# EAGLE design INA2321Bioamp (EAGLE 7.4.0)
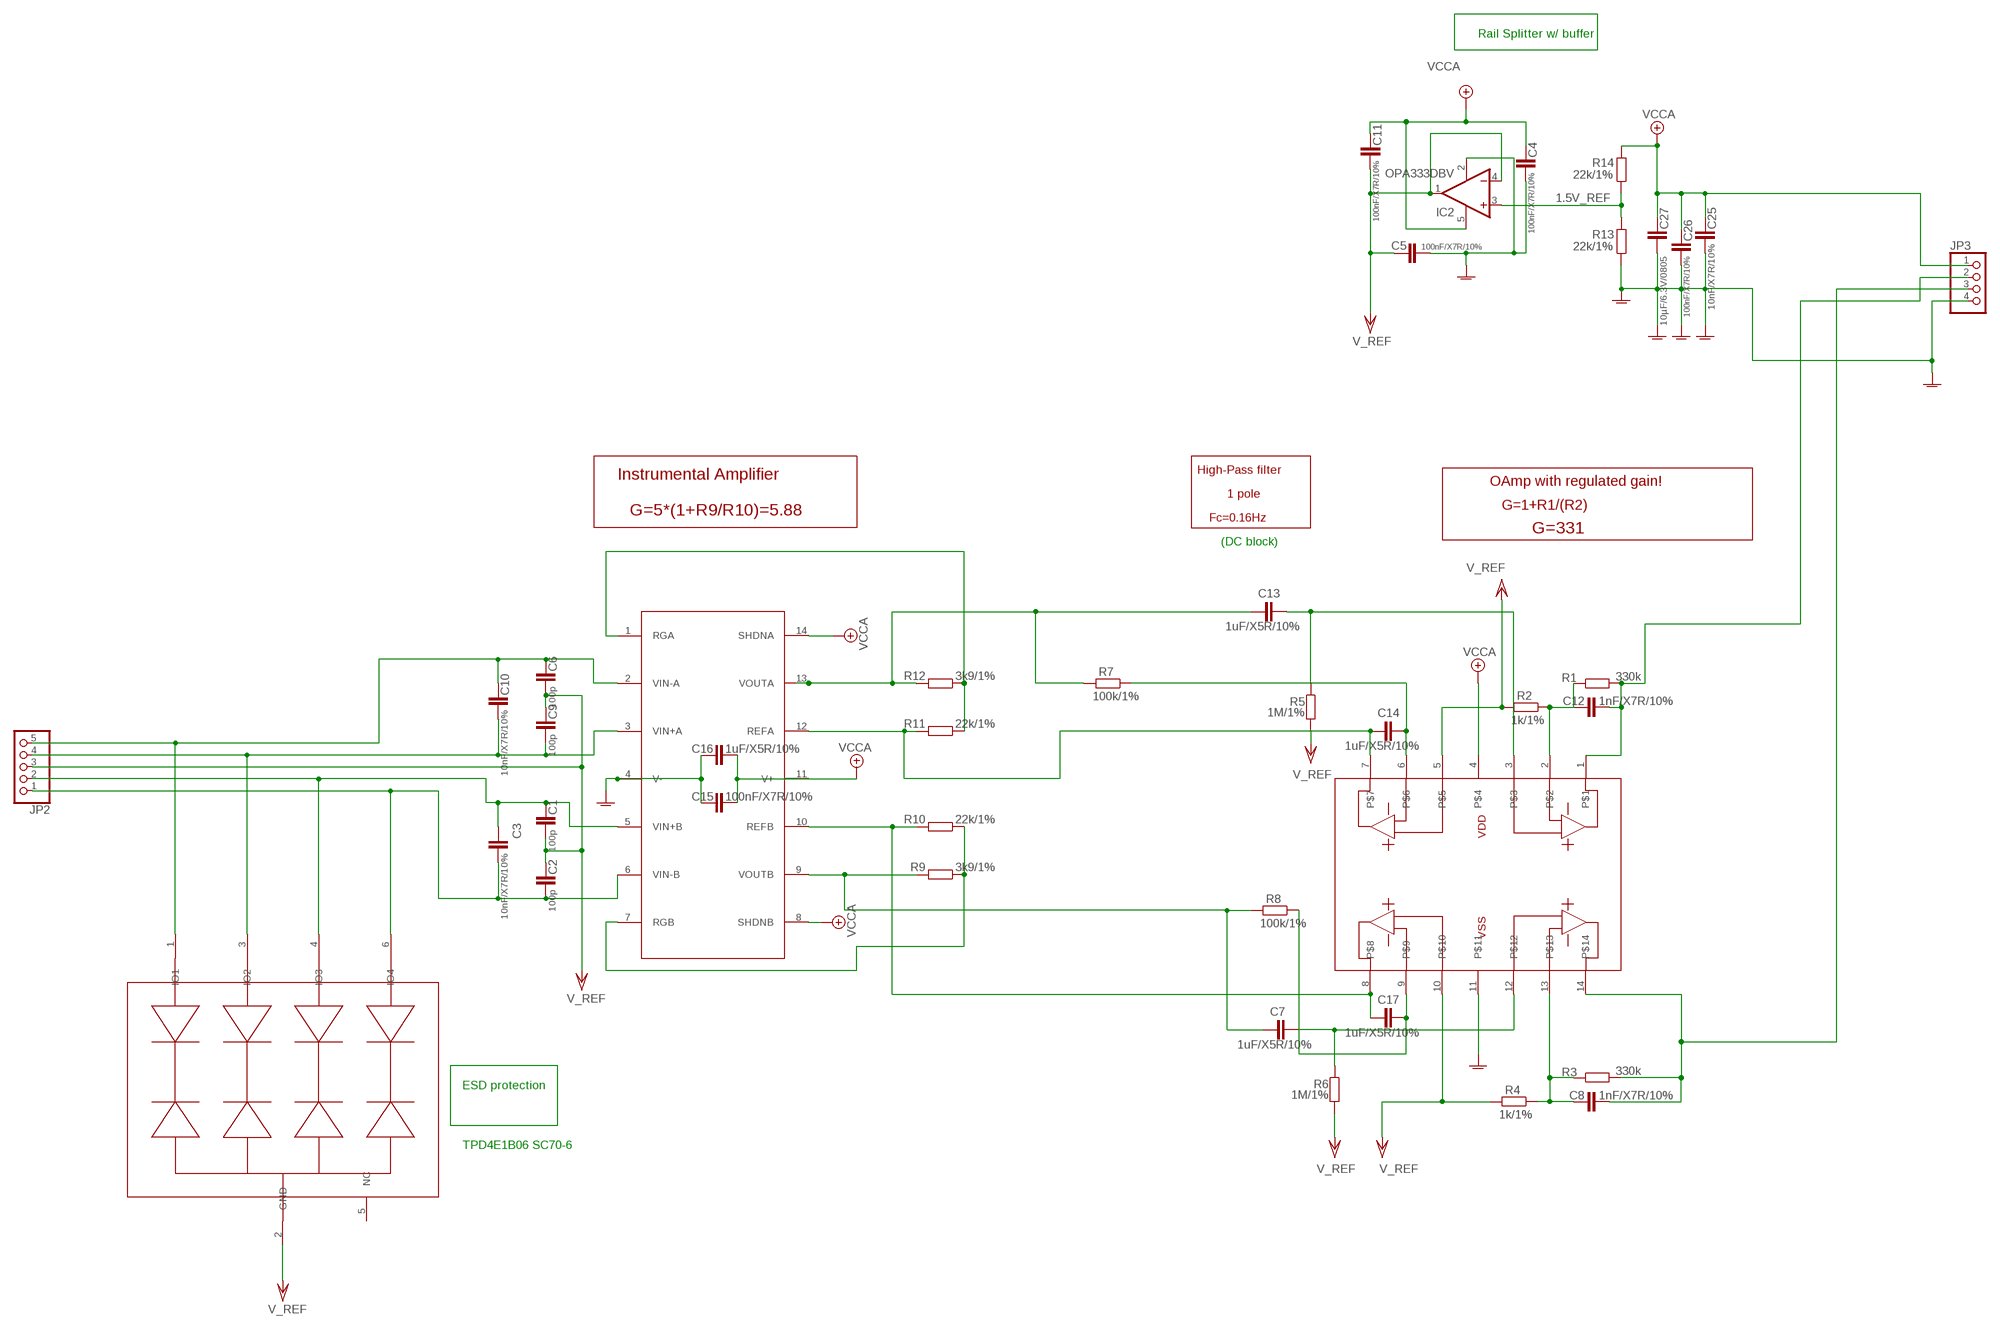
[diagram p0: schematic, sheet 1]

## Parts
C1  100p  C-EUC0603_DWS  [C0603_DWS]
C2  100p  C-EUC0603_DWS  [C0603_DWS]
C3  10nF/X7R/10%  C-EUC0603_DWS  [C0603_DWS]
C4  100nF/X7R/10%  C-EUC0603_DWS  [C0603_DWS]
C5  100nF/X7R/10%  C-EUC0603_DWS  [C0603_DWS]
C6  100p  C-EUC0603_DWS  [C0603_DWS]
C7  1uF/X5R/10%  C-EUC0603_DWS  [C0603_DWS]
C8  1nF/X7R/10%  C-EUC0603_DWS  [C0603_DWS]
C9  100p  C-EUC0603_DWS  [C0603_DWS]
C10  10nF/X7R/10%  C-EUC0603_DWS  [C0603_DWS]
C11  100nF/X7R/10%  C-EUC0603_DWS  [C0603_DWS]
C12  1nF/X7R/10%  C-EUC0603_DWS  [C0603_DWS]
C13  1uF/X5R/10%  C-EUC0603_DWS  [C0603_DWS]
C14  1uF/X5R/10%  C-EUC0603_DWS  [C0603_DWS]
C15  100nF/X7R/10%  C-EUC0603_DWS  [C0603_DWS]
C16  1uF/X5R/10%  C-EUC0603_DWS  [C0603_DWS]
C17  1uF/X5R/10%  C-EUC0603_DWS  [C0603_DWS]
C25  10nF/X7R/10%  C-EUC0603_DWS  [C0603_DWS]
C26  100nF/X7R/10%  C-EUC0603_DWS  [C0603_DWS]
C27  10µF/6.3V/0805  C-EUC0805_5MIL_DWS  [C0805_5MIL_DWS]
IC2  OPA333DBV  [SOT23-5]
JP2  PINHD-1X5  [1X05]
JP3  PINHD-1X4  [1X04]
R1  330k  R-EU_R0603_5MIL_DWS  [R0603_5MIL_DWS]
R2  1k/1%  R-EU_R0603_5MIL_DWS  [R0603_5MIL_DWS]
R3  330k  R-EU_R0603_5MIL_DWS  [R0603_5MIL_DWS]
R4  1k/1%  R-EU_R0603_5MIL_DWS  [R0603_5MIL_DWS]
R5  1M/1%  R-EU_R0603_5MIL_DWS  [R0603_5MIL_DWS]
R6  1M/1%  R-EU_R0603_5MIL_DWS  [R0603_5MIL_DWS]
R7  100k/1%  R-EU_R0603_5MIL_DWS  [R0603_5MIL_DWS]
R8  100k/1%  R-EU_R0603_5MIL_DWS  [R0603_5MIL_DWS]
R9  3k9/1%  R-EU_R0603_5MIL_DWS  [R0603_5MIL_DWS]
R10  22k/1%  R-EU_R0603_5MIL_DWS  [R0603_5MIL_DWS]
R11  22k/1%  R-EU_R0603_5MIL_DWS  [R0603_5MIL_DWS]
R12  3k9/1%  R-EU_R0603_5MIL_DWS  [R0603_5MIL_DWS]
R13  22k/1%  R-EU_R0603_5MIL_DWS  [R0603_5MIL_DWS]
R14  22k/1%  R-EU_R0603_5MIL_DWS  [R0603_5MIL_DWS]
U$1  INA2321  [TSSOP14]
U$2  TPD4E1B06  [SC70-6L]
U$3  MCP609  [TSSOP14]

## Nets
1.5V_REF: IC2.3(+IN) R13.2 R14.1
+5V: C4.1 C11.1 C15.2 C16.2 C25.1 C26.1 C27.1 IC2.5(V+) JP3.1 R14.2 U$1.8(SHDNB) U$1.11(V+) U$1.14(SHDNA) U$3.4 ; supply symbol labelled VCCA
GNDA: C4.2 C5.2 C15.1 C16.1 C25.2 C26.2 C27.2 IC2.2(V-) JP3.4 R13.1 U$1.4(V-) U$3.11
N$1: C8.2 JP3.3 R3.2 U$3.14
N$2: C6.1 C10.1 JP2.5 U$1.2(VIN-A) U$2.1(IO1)
N$3: C13.1 R7.2 R12.2 U$1.13(VOUTA)
N$4: R11.1 R12.1 U$1.1(RGA)
N$5: C13.2 R5.1 U$3.3
N$6: C12.1 R1.1 R2.1 U$3.2
N$7: C12.2 JP3.2 R1.2 U$3.1
N$8: C9.2 C10.2 JP2.4 U$1.3(VIN+A) U$2.3(IO2)
N$9: R9.1 R10.1 U$1.7(RGB)
N$11: C1.1 C3.1 JP2.2 U$1.5(VIN+B) U$2.4(IO3)
N$13: C2.2 C3.2 JP2.1 U$1.6(VIN-B) U$2.6(IO4)
N$15: C14.2 R7.1 U$3.6
N$17: C17.2 R8.1 U$3.9
N$18: C17.1 R10.2 U$1.10(REFB) U$3.8
N$19: C14.1 R11.2 U$1.12(REFA) U$3.7
N$20: C7.2 R6.1 U$3.12
N$83: C7.1 R8.2 R9.2 U$1.9(VOUTB)
N$105: C8.1 R3.1 R4.1 U$3.13
VCC/2: C1.2 C2.1 C5.1 C6.2 C9.1 C11.2 IC2.1(OUT) IC2.4(-IN) JP2.3 R2.2 R4.2 R5.2 R6.2 U$2.2(GND) U$3.5 U$3.10 ; supply symbol labelled V_REF
Unconnected: U$2.5(NC)

## Notes on the sheet
- Rail Splitter w/ buffer
- High-Pass filter
- Instrumental Amplifier
- OAmp with regulated gain!
- 1 pole
- G=1+R1/(R2)
- G=5*(1+R9/R10)=5.88
- Fc=0.16Hz
- G=331
- (DC block)
- ESD protection
- TPD4E1B06 SC70-6

## Library data of the parts
C1-C17 C25-C27 = rcl:C-EU: CAPACITOR, European symbol
IC2 = linear:OPA333: 1.8V, microPOWER CMOS OPERATIONAL AMPLIFIERS Zerø-Drift Series Source: Texas Instruments (Burr-Brown) .. U11 opa333 Operational Amp.pdf
JP2 = pinhead:PINHD-1X5: PIN HEADER
JP3 = pinhead:PINHD-1X4: PIN HEADER
R1-R14 = rcl:R-EU_: RESISTOR, European symbol
U$1 = INA2321:INA2321
U$2 = TPD4E1B06:TPD4E1B06
U$3 = MCP609tssop:MCP609

## Net classes
1 pwr: width 0.4 mm, drill 0.6 mm, clearance 0.23 mm

## Board
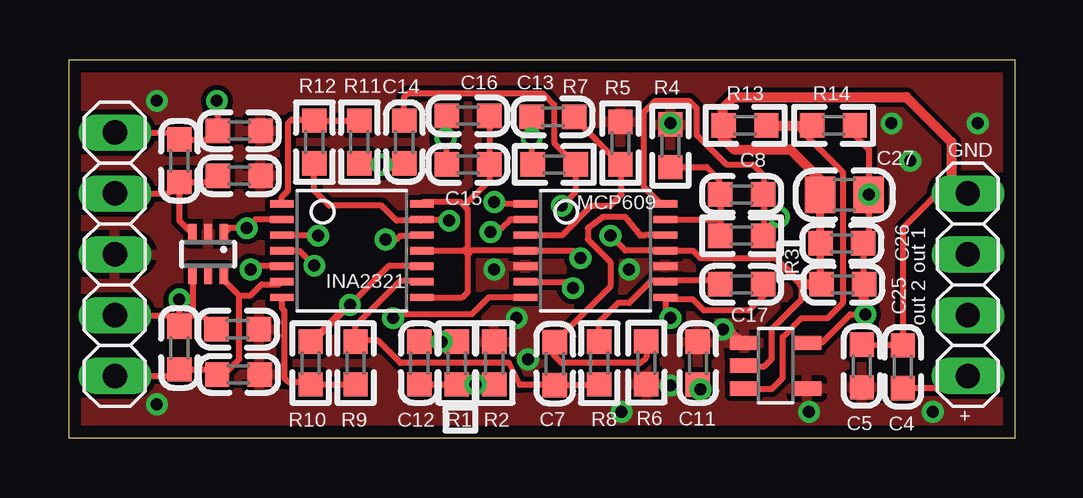
[diagram p1: board, top side]
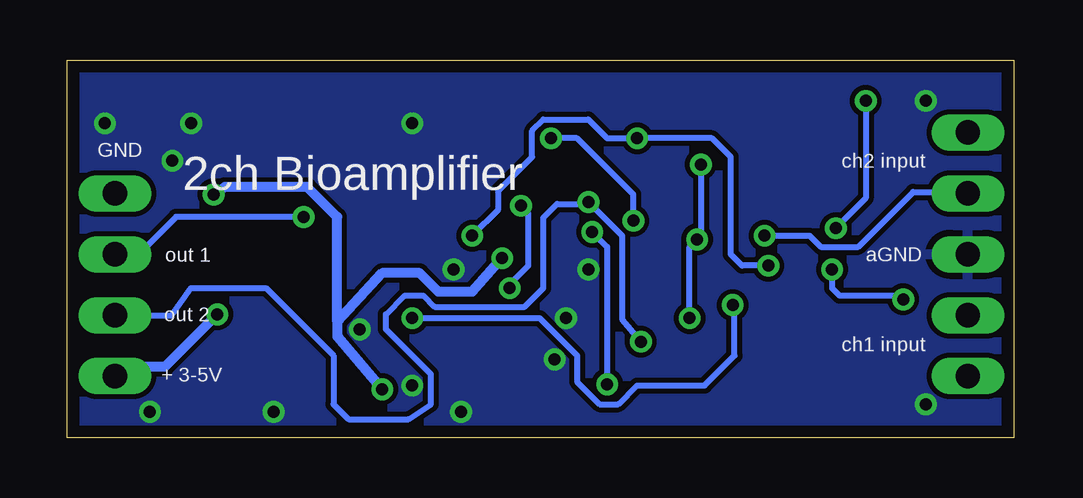
[diagram p2: board, bottom side, seen from below]

Size 39.46 x 15.75 mm. Coordinates in mm from the lower left corner, seen from the top.
Outline: 0,0 39.46,0 39.46,15.75 0,15.75 0,0
Copper layers (1*16): Top 0.035mm / dielectric 1.5mm / Bottom 0.035mm
Design rules "default *": minimum track width 10mil, minimum drill 24mil, track to track 8mil, track to pad 8mil, pad to pad 8mil, via to via 8mil, smd to smd 8mil, copper to edge 20mil, drill to drill 8mil, minimum pad ring 10mil, minimum via ring 8mil, stop-mask expansion 4mil, vias tented up to drill 0.60198125mm, thermal gap 10mil

### Footprints (pad centres in the part's own frame; a part is rotated, then mirrored left to right if it is on the bottom)
C0603_DWS = smd 1.016 x 1.016: 1 -0.889,0; 2 0.889,0
C0805_5MIL_DWS = smd 1.27 x 1.524: 1 -1.016,0; 2 1.016,0
SOT23-5 = smd 0.6 x 1.2: 1 -0.95,-1.306; 2 0,-1.306; 3 0.95,-1.306; 4 0.95,1.306; 5 -0.95,1.306
1X05 = drill 1.016 long: 1 -5.08,0; 2 -2.54,0; 3 0,0; 4 2.54,0; 5 5.08,0
1X04 = drill 1.016 long: 1 -3.81,0; 2 -1.27,0; 3 1.27,0; 4 3.81,0
R0603_5MIL_DWS = smd 1.016 x 1.016: 1 -0.889,0; 2 0.889,0
TSSOP14 = smd 0.305 x 0.991: 1 -1.95,-2.918; 2 -1.3,-2.918; 3 -0.65,-2.918; 4 0,-2.918; 5 0.65,-2.918; 6 1.3,-2.918; 7 1.95,-2.918; 8 1.95,2.918; 9 1.3,2.918; 10 0.65,2.918; 11 0,2.918; 12 -0.65,2.918; 13 -1.3,2.918; 14 -1.95,2.918
SC70-6L = smd 0.35 x 0.8: 1 -0.65,-0.85; 2 0,-0.85; 3 0.65,-0.85; 4 0.65,0.85; 5 0,0.85; 6 -0.65,0.85

### Placement (x,y rotation side)
C1  7.04,4.52 0 top
C2  7.07,2.63 180 top
C3  4.61,3.73 270 top
C4  34.76,2.95 90 top
C5  33.06,2.99 90 top
C6  7.11,12.8 0 top
C7  20.25,3.08 90 top
C8  28.05,10.14 0 top
C9  7.11,10.92 180 top
C10  4.61,11.55 270 top
C11  26.22,3.11 90 top
C12  14.61,3.11 90 top
C13  20.18,13.38 0 top
C14  13.98,12.33 90 top
C15  16.64,11.39 0 top
C16  16.64,13.42 0 top
C17  28.05,6.39 180 top
C25  32.26,6.39 180 top
C26  32.22,8.1 180 top
C27  32.32,10.12 180 top
IC2  29.46,3 270 top
JP2  1.92,7.64 90 top
JP3  37.48,6.38 90 top
R1  16.17,3.11 90 top
R2  17.73,3.11 90 top
R3  28.05,8.42 0 top
R4  25.08,12.17 90 top
R5  22.99,12.28 90 top
R6  24.07,3.12 270 top
R7  20.23,11.39 180 top
R8  22.11,3.11 270 top
R9  11.95,3.11 90 top
R10  10.08,3.11 90 top
R11  12.11,12.33 270 top
R12  10.23,12.33 270 top
R13  28.19,13.02 0 top
R14  31.88,13.02 0 top
U$1  11.79,7.8 270 top
U$2  5.81,7.65 180 top
U$3  21.95,7.8 270 top

### Tracks (layer width: path | path; a pad name or v marks a point on that pad's centre or on a via)
1.5V_REF
  Top 0.254: R13.2 30.32,13.02 32.26,11.08 32.26,5.61 31.64,4.98 30.55,4.98 29.76,4.2 29.76,2.48 29.3,2.02 28.19,2.02 IC2.3
  Top 0.406: R13.2 R14.1
+5V  (via drill 0.5)
  Top 0.254: U$1.8 16.41,5.85 16.64,6.08 16.64,7.64 | 16.64,7.64 16.48,7.8 | U$1.11 16.48,7.8 | 16.48,7.8 16.64,7.95 16.64,9.52 16.48,9.67 | 16.48,9.67 16.33,9.83 14.79,9.83 U$1.14 | C16.2 C15.2 17.53,10.72 16.48,9.67 | 16.64,7.64 16.8,7.8 U$3.4 21.01,7.8 v21.33,7.48 | 34.45,2.17 C4.1 36.98,2.06 JP3.1 | R14.2 32.77,12.61 33.36,12.02 v33.36,10.13 C27.1 | C27.1 33.34,8.33 C26.1 33.11,6.43 C25.1 | C27.1 33.8,10.12 v33.36,10.14 | 26.33,2.11 C11.1 26.33,2.17 v26.33,2.02 | IC2.5 31.39,3.95 32.58,5.14 v33.2,5.14
  Top 0.406: 33.11,6.43 33.11,5.23 v33.2,5.14
  Bottom 0.254: 32.89,10.45 v33.36,10.14 | 28.2,4.2
  Bottom 0.406: v33.2,5.14 35.39,2.95 37.09,2.95 JP3.1 | v21.33,7.48 22.58,6.08 23.98,6.08 24.76,6.86 26.33,6.86 28.2,4.83 | 28.2,4.83 28.2,4.2 | 28.2,4.83 28.2,9.2 29.45,10.45 32.89,10.45 | v33.36,10.14 32.9,10.45 | 28.2,4.2 v26.33,2.02
GNDA  (via drill 0.5)
  Top 0.254: U$1.4 9.61,7.8 v10.23,7.17 | C16.1 15.7,12.9 v15.7,12.48 15.75,12.44 C15.1 | v22.58,8.42 23.2,7.8 U$3.11 26.01,7.8 26.33,7.48 29.45,7.48 29.84,7.09 30.08,6.86 | C5.2 32.77,3.84 C4.2 34.76,8.73 36.33,10.3 36.8,10.3 37.36,10.3 JP3.4 | C25.2 31.38,10.72 | 30.55,6.39 30.55,5.77 29.3,4.52 29.3,3.27 28.98,2.95 28.2,2.95 IC2.2
  Top 0.305: R13.1 27.3,12.45 27.73,12.02 | 30.08,12.02 31.33,10.77 31.33,10.14 C27.2 31.31,8.12 C26.2 31.33,6.43 C25.2 | 30.55,6.39 29.84,7.09
  Top 0.406: C25.2 30.55,6.39 | 31.38,10.72 30.08,12.02 27.73,12.02 27.26,12.48 27.26,13.73 27.73,14.2 34.92,14.2 36.8,12.33 36.8,10.3
  Bottom 0.254: v10.23,7.17 11.33,7.17 11.79,7.64 11.79,11.7 12.58,12.48 v15.7,12.48 16.95,12.48 17.73,13.27 19.61,13.27 20.08,12.8 20.08,11.7 21.48,10.3 21.48,9.52 v22.58,8.42
N$1  (via drill 0.5)
  Top 0.254: 28.98,8.58 28.98,10.3 28.93,10.25 C8.2 28.98,10.19 28.98,10.92 28.51,11.39 27.42,11.39 26.17,12.64 26.17,13.73 25.86,14.05 24.45,14.05 23.98,13.58 23.98,10.45 24.69,9.75 U$3.14 | R3.2 28.98,8.47 28.98,8.58 | 28.98,8.58 v29.61,9.2
  Bottom 0.254: v29.61,9.2 34.92,9.2 36.48,7.64 JP3.3
N$2  (via drill 0.5)
  Top 0.254: JP2.5 4.32,12.72 C10.1 5.86,12.44 C6.1 6.22,14 v6.17,14.05 | U$2.1 6.69,8.73 v7.42,8.73 7.78,9.1 U$1.2
  Bottom 0.254: v6.17,14.05 6.17,9.98 v7.42,8.73
N$3  (via drill 0.5)
  Top 0.254: v15.86,9.05 15.81,9.1 U$1.13 14.66,9.05 13.67,9.05 13.04,9.67 10.86,9.67 10.23,10.3 R12.2 | C13.1 v19.3,12.48 19.3,11.44 R7.2
  Bottom 0.254: v15.86,9.05 15.86,10.14 18.2,12.48 v19.3,12.48
N$4
  Top 0.254: U$1.1 8.88,10.04 9.14,10.3 9.14,13.11 9.29,13.27 10.18,13.27 R12.1 R11.1
N$5
  Top 0.254: C13.2 21.07,13.32 R5.1 23.05,11.34 23.05,10.14 22.58,9.67 21.8,9.67 20.57,8.45 U$3.3
N$6  (via drill 0.5)
  Top 0.254: C12.1 R1.1 v16.95,2.22 R2.1 | U$3.2 18.41,9.1 18.05,8.73 17.73,8.73 v17.58,8.58
  Bottom 0.254: v17.58,8.58 16.95,7.95 v16.95,2.22
N$7  (via drill 0.5)
  Top 0.254: C12.2 v15.54,4 R1.2 | U$3.1 17.81,9.75 v17.73,9.83
  Bottom 0.254: v15.54,4 16.33,4.94 16.33,8.42 v17.73,9.83 17.65,9.75 U$3.1 19.61,9.17 19.61,6.23 20.39,5.45 24.14,5.45 24.61,5.92 25.39,5.92 26.17,5.14 26.17,4.52 24.3,2.64 24.3,1.39 25.23,0.77 27.73,0.77 28.36,1.39 28.36,3.42 31.17,6.23 34.3,6.23 35.11,5.11 JP3.2
N$8  (via drill 0.5)
  Top 0.254: JP2.4 4.13,10.18 C10.2 | C10.2 4.61,9.05 U$2.3 | C10.2 5.95,10.66 C9.2 | U$1.3 10.36,8.45 v10.39,8.42
  Bottom 0.254: v10.39,8.42 8.51,8.42 8.04,7.95 6.48,7.95 4.19,10.24 1.97,10.24 JP2.4
N$9
  Top 0.254: U$1.7 8.88,5.4 8.98,5.3 8.98,2.48 9.14,2.33 9.97,2.33 R10.1 R9.1
N$11  (via drill 0.5)
  Top 0.254: JP2.2 4.13,5.11 | 4.13,5.11 C3.1 v4.61,5.77 | 4.13,5.11 5.08,5.11 | 5.08,5.11 5.57,5.11 C1.1 | U$2.4 5.16,5.19 5.08,5.11 | U$1.5 7.71,7.15 v7.58,7.02
  Bottom 0.254: v7.58,7.02 7.58,6.23 7.26,5.92 4.76,5.92 v4.61,5.77
N$13
  Top 0.254: JP2.1 4.33,2.56 C3.2 5.97,2.85 C2.2 6.47,2.63 7.11,3.27 7.11,5.92 | U$2.6 6.46,6.57 7.11,5.92 | 7.11,5.92 7.58,5.92 8.04,6.39 8.77,6.39 U$1.6
N$15  (via drill 0.5)
  Top 0.254: C14.2 13.98,14.2 14.14,14.36 19.76,14.36 20.23,13.89 20.23,12.28 R7.1 21.12,10.25 v20.55,9.67 | U$3.6 20.75,6.5 v21.01,6.23
  Bottom 0.254: v21.01,6.23 21.01,6.39 20.23,7.17 20.23,9.36 v20.55,9.67
N$17
  Top 0.254: R8.1 22.11,4.83 22.89,5.61 23.36,5.61 24.3,6.55 24.82,6.55 U$3.9 24.92,6.55 26.8,6.55 26.95,6.39 C17.2
N$18  (via drill 0.5)
  Top 0.254: v11.72,5.53 10.18,4 R10.2 11.61,5.53 v11.72,5.53 | v11.72,5.53 13.36,7.17 14.69,7.17 U$1.10 | C17.1 28.93,5.87 28.36,5.3 26.48,5.3 26.01,5.77 24.95,5.77 U$3.8 24.87,5.19 v25.08,4.98
  Bottom 0.254: v25.08,4.98 19.76,4.98 18.2,3.42 18.2,2.33 17.26,1.39 16.48,1.39 15.7,2.17 12.89,2.17 11.64,3.42 11.64,5.45 v11.72,5.53
N$19  (via drill 0.5)
  Top 0.254: R11.2 C14.1 13.09,11.44 v13.04,11.39 | v13.2,8.27 13.67,8.27 13.83,8.42 14.69,8.42 U$1.12 | U$3.7 17.5,5.85 16.8,5.14 13.67,5.14 v13.51,4.98
  Bottom 0.254: v13.04,11.39 13.04,8.42 v13.2,8.27 13.51,7.95 v13.51,4.98
N$20
  Top 0.254: R6.1 24.07,3.35 23.83,3.11 20.55,3.11 20.23,3.42 20.23,3.95 C7.2 | 20.39,4.11 C7.2 | U$3.12 24.01,8.45 23.98,8.42 23.83,8.42 23.2,9.2 22.26,9.2 21.64,8.73 21.64,8.27 22.58,7.33 22.58,6.3 C7.2
N$83
  Top 0.254: U$1.9 14.66,6.55 13.83,6.55 11.95,4.67 R9.2 12,4.05 12.89,4.05 13.83,3.11 18.36,3.11 18.8,2.2 C7.1 22.08,2.2 R8.2
N$105
  Top 0.254: R4.1 26.59,11.28 27.11,10.77 27.11,10.19 C8.1 27.16,9.05 | 27.16,9.05 R3.1 | U$3.13 27.11,9.1 27.16,9.05
VCC/2  (via drill 0.5)
  Top 0.254: v27.26,4.52 27.59,4.52 IC2.1
  other vias: 17.73,7.02 18.67,4.98 19.14,3.27 23.36,7.02 34.3,13.11 25.08,13.11 3.67,1.39 3.67,14.05 36.01,1.08 30.86,1.08 23.05,1.08 25.08,2.17 37.89,13.11 35.08,11.55
  pour Top: -10.48,17.66 53.43,17.66 53.43,-2.91 -10.48,-2.91
  pour Bottom: -9.62,19.31 54.44,19.06 53.98,-2.16 -9.3,-2.16

### Text on the board
tPlace: GND | MCP609 | INA2321 | out 1 | out 2 | +
bPlace: ch2 input | GND | 2ch Bioamplifier | aGND | out 1 | out 2 | ch1 input | + 3-5V